# Altium schematic sheet Slave.SchDoc
size A
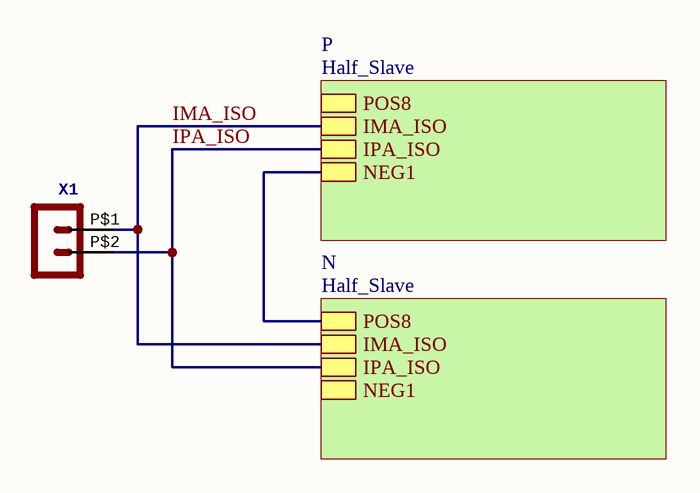
[diagram p0: Slave.SchDoc]

## Parts
X1  Molex - Micro-Fit 3.0 Series connector,  3.00mm (0.118") pitch header, 2 positions.  [43650-0224]  (value not drawn)

## Sub-sheets
N = Half_Slave: POS8, IMA_ISO, IPA_ISO, NEG1
P = Half_Slave: POS8, IMA_ISO, IPA_ISO, NEG1

## Nets
IMA_ISO: X1.P$1 ; sheet P/IMA_ISO, sheet N/IMA_ISO
IPA_ISO: X1.P$2 ; sheet P/IPA_ISO, sheet N/IPA_ISO
(unnamed): sheet P/NEG1, sheet N/POS8

## Library data of the parts
X1 = POS2_MF43650-0224: GateName_1: G$1; SymbolName_1: HEADER_POS2; DeviceSetName: HEADER_POS2_?; DeviceName: 43650-0224; LibraryName: MOLEX Micro-Fit; Package: 43650-0224